# Altium schematic sheet FilterControl.Schematic.SchDoc
size A
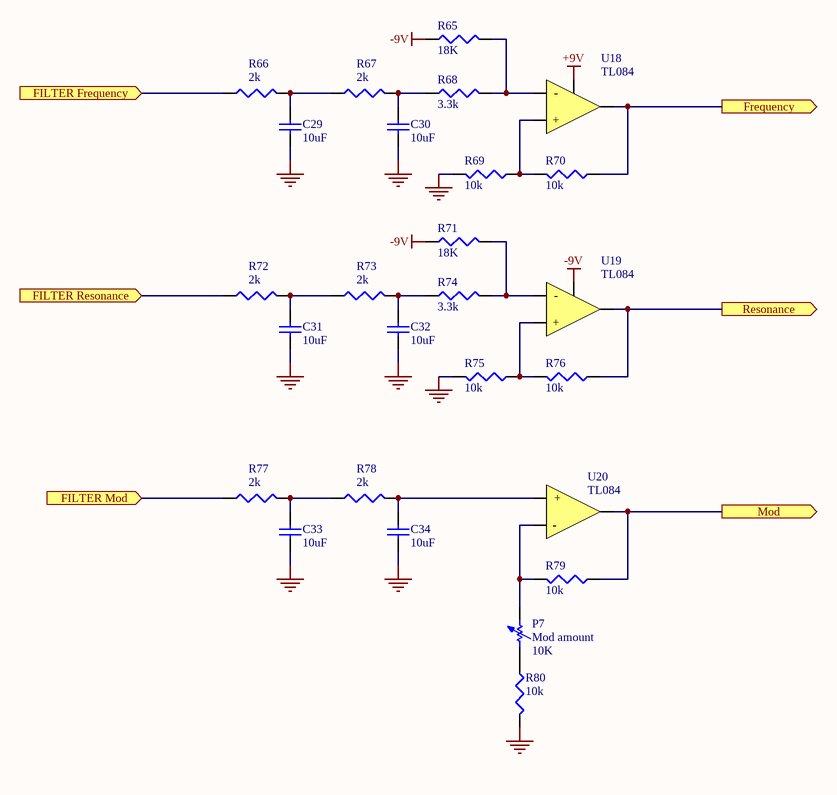
[diagram p0: FilterControl.Schematic.SchDoc]

## Parts
C29  10uF  [CAPC1608N]
C30  10uF  [CAPC1608N]
C31  10uF  [CAPC1608N]
C32  10uF  [CAPC1608N]
C33  10uF  [CAPC1608N]
C34  10uF  [CAPC1608N]
P7  Mod amount  value 10K  [AXIAL-0.7]
R65  18K  [CAPC1608N]
R66  2k  [CAPC1608N]
R67  2k  [CAPC1608N]
R68  3.3k  [CAPC1608N]
R69  10k  [CAPC1608N]
R70  10k  [CAPC1608N]
R71  18K  [CAPC1608N]
R72  2k  [CAPC1608N]
R73  2k  [CAPC1608N]
R74  3.3k  [CAPC1608N]
R75  10k  [CAPC1608N]
R76  10k  [CAPC1608N]
R77  2k  [CAPC1608N]
R78  2k  [CAPC1608N]
R79  10k  [CAPC1608N]
R80  10k  [CAPC1608N]
U18  TL084  [TL084_3PADS+ALIM]
U19  TL084  [TL084_3PADS+ALIM]
U20  TL084  [TL084_3PADS]

## Ports
FILTER Frequency (in), FILTER Mod (in), FILTER Resonance (in), Frequency (out), Mod (out), Resonance (out)

## Nets
+9V: U18.4(VCC+)
-9V: R65.1 R71.1 U19.4(VCC+)
GND: C29.1 C30.1 C31.1 C32.1 C33.1 C34.1 R69.2 R75.2 R80.2
FILTER Frequency: R66.1 ; port FILTER Frequency
FILTER Mod: R77.1 ; port FILTER Mod
FILTER Resonance: R72.1 ; port FILTER Resonance
Frequency: R70.1 U18.1(OUT) ; port Frequency
Mod: R79.1 U20.1(OUT) ; port Mod
Resonance: R76.1 U19.1(OUT) ; port Resonance
NetC29_2: C29.2 R66.2 R67.1
NetC30_2: C30.2 R67.2 R68.1
NetC31_2: C31.2 R72.2 R73.1
NetC32_2: C32.2 R73.2 R74.1
NetC33_2: C33.2 R77.2 R78.1
NetC34_2: C34.2 R78.2 U20.3(+)
NetP7_1: P7.1 R80.1
NetP7_2: P7.2 R79.2 U20.2(-)
NetR65_2: R65.2 R68.2 U18.2(-)
NetR69_1: R69.1 R70.2 U18.3(+)
NetR71_2: R71.2 R74.2 U19.2(-)
NetR75_1: R75.1 R76.2 U19.3(+)

## Library data of the parts
C29-C34 = Cap Semi: Capacitor (Semiconductor SIM Model); Value: 10u; Published: 8-Jun-2000; LatestRevisionDate: 29-May-2009; LatestRevisionNote: IPC-7351 Footprint Added.; PackageReference: C1206; Publisher: Altium Limited; PackageDescription: Chip Capacitor
P7 = Res Adj1: Variable Resistor; Set Position: 0.5; Published: 8-Jun-2000; LatestRevisionDate: 17-Jul-2002; LatestRevisionNote: Re-released for DXP Platform.; PackageReference: AXIAL-0.7; Publisher: Altium Limited; PackageDescription: Axial Device, Thru-Hole; 2 Leads; 0.7 in Pin Spacing
R65-R80 = Res3: Resistor; Published: 8-Jun-2000; LatestRevisionDate: 29-May-2009; LatestRevisionNote: IPC-7351 Footprint Added.; PackageReference: J1-0603; Publisher: Altium Limited; PackageDescription: Chip Resistor
  R65 R71: Value: 18K
  R66 R67 R72 R73 R77 R78: Value: 2K
  R68 R74: Value: 3.3K
  R69 R70 R75 R76 R79 R80: Value: 10K
U18-U20 = TL084: Ref_Fabricant: TL084BCD; Fabricant: Fairchild Semiconductor; Datasheet: http://www.farnell.com/datasheets/1882473.pdf; Ref_Farnell: 9593438